# Altium schematic sheet Sheet1.SchDoc
size A2; SheetNumber: 1; SheetTotal: 1
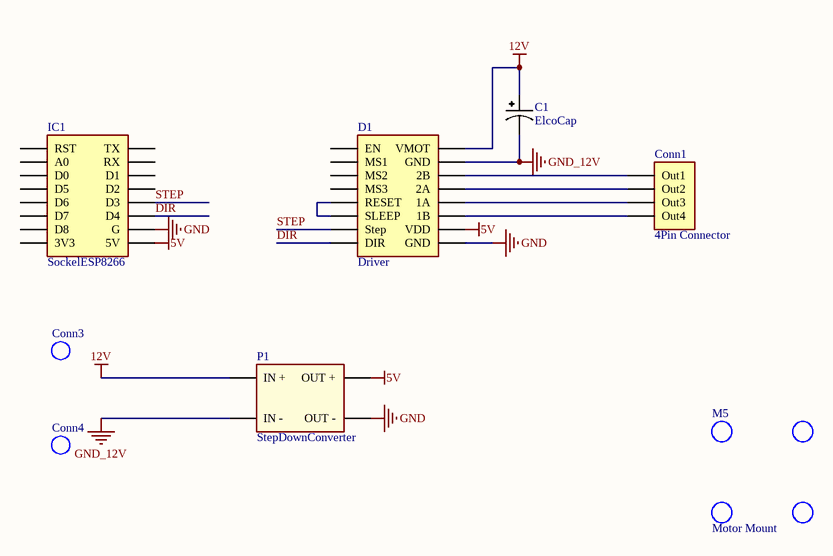
[diagram p0: Sheet1.SchDoc]

## Parts
C1  ElcoCap  [ElcCap]
Conn1  4Pin Connector  [4Pin Connector]
Conn3  MountHole  [MountHOle]  (value not drawn)
Conn4  MountHole  [MountHOle]  (value not drawn)
D1  Driver  [DiverSockel]
IC1  SockelESP8266  [ESP8266 Sockel]
M5  Motor Mount  [Motor Mount]
P1  StepDownConverter  [StepDownConverter]

## Nets
5V: D1.15(VDD) IC1.1(5V) P1.3(OUT_+)
12V: C1.1(P) D1.9(VMOT) P1.1(IN_+)
GND: D1.16(GND) IC1.2(G) P1.4(OUT_-)
GND_12V: C1.2(N) D1.10(GND) P1.2(IN_-)
DIR: D1.8(DIR) IC1.3(D4)
STEP: D1.7(Step) IC1.4(D3)
NetConn1_1: Conn1.1(Out1) D1.11(2B)
NetConn1_2: Conn1.2(Out2) D1.12(2A)
NetConn1_3: Conn1.3(Out3) D1.13(1A)
NetConn1_4: Conn1.4(Out4) D1.14(1B)
NetD1_5: D1.5(RESET) D1.6(SLEEP)

Not connected (* = marked no-connect by the designer): D1 1(EN) 2(MS1) 3(MS2) 4(MS3); IC1 5(D2) 6(D1) 7(RX) 8(TX) 9(3V3) 10(D8) 11(D7) 12(D6) 13(D5) 14(D0) 15(A0) 16(RST)

## Library data of the parts
IC1 = SockelESP8266: ESP8266 D1 mini Sockel